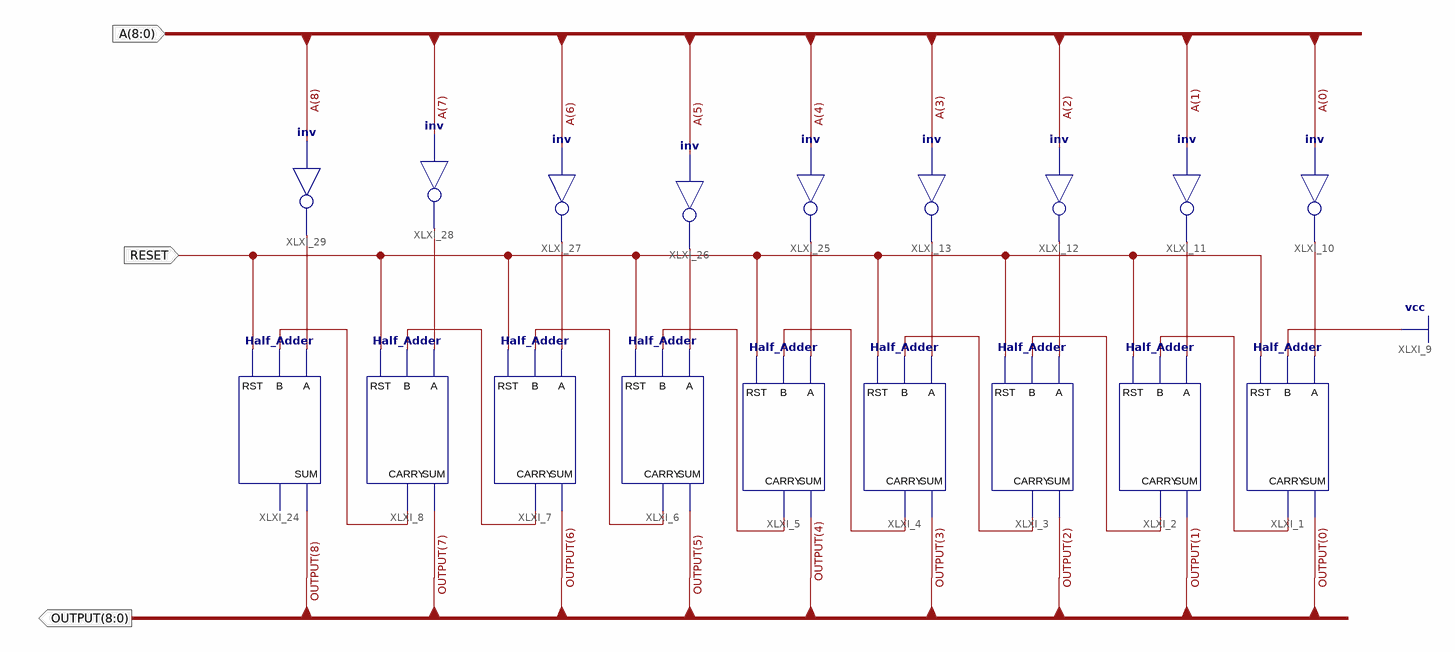
[diagram p0: schematic sheet 1]
// Xilinx ISE schematic Nine_Bit_Twos_Complement.sch (spartan6) as structural Verilog: 18 symbols, 3 ports
module Nine_Bit_Twos_Complement (
  input  RESET,
  input  [8:0] A,
  output [8:0] OUTPUT
);

  wire XLXN_2, XLXN_3, XLXN_4, XLXN_5, XLXN_8, XLXN_9, XLXN_10, XLXN_11, XLXN_13, XLXN_28, XLXN_32, XLXN_47,
       XLXN_56, XLXN_57, XLXN_58, XLXN_59, XLXN_60;

  Half_Adder XLXI_2 (.A(XLXN_3), .B(XLXN_8), .CARRY(XLXN_9), .RST(RESET), .SUM(OUTPUT[1]));
  Half_Adder XLXI_3 (.A(XLXN_4), .B(XLXN_9), .CARRY(XLXN_10), .RST(RESET), .SUM(OUTPUT[2]));
  Half_Adder XLXI_4 (.A(XLXN_5), .B(XLXN_10), .CARRY(XLXN_11), .RST(RESET), .SUM(OUTPUT[3]));
  Half_Adder XLXI_5 (.A(XLXN_60), .B(XLXN_11), .CARRY(XLXN_28), .RST(RESET), .SUM(OUTPUT[4]));
  Half_Adder XLXI_6 (.A(XLXN_59), .B(XLXN_28), .CARRY(XLXN_13), .RST(RESET), .SUM(OUTPUT[5]));
  Half_Adder XLXI_7 (.A(XLXN_58), .B(XLXN_13), .CARRY(XLXN_32), .RST(RESET), .SUM(OUTPUT[6]));
  Half_Adder XLXI_8 (.A(XLXN_57), .B(XLXN_32), .CARRY(XLXN_47), .RST(RESET), .SUM(OUTPUT[7]));
  Half_Adder XLXI_1 (.A(XLXN_2), .B(1'b1), .CARRY(XLXN_8), .RST(RESET), .SUM(OUTPUT[0]));
  not XLXI_10 (XLXN_2, A[0]);
  not XLXI_11 (XLXN_3, A[1]);
  not XLXI_13 (XLXN_5, A[3]);
  not XLXI_12 (XLXN_4, A[2]);
  Half_Adder XLXI_24 (.A(XLXN_56), .B(XLXN_47), .RST(RESET), .SUM(OUTPUT[8]));  // open: CARRY
  not XLXI_25 (XLXN_60, A[4]);
  not XLXI_26 (XLXN_59, A[5]);
  not XLXI_27 (XLXN_58, A[6]);
  not XLXI_28 (XLXN_57, A[7]);
  not XLXI_29 (XLXN_56, A[8]);
endmodule
